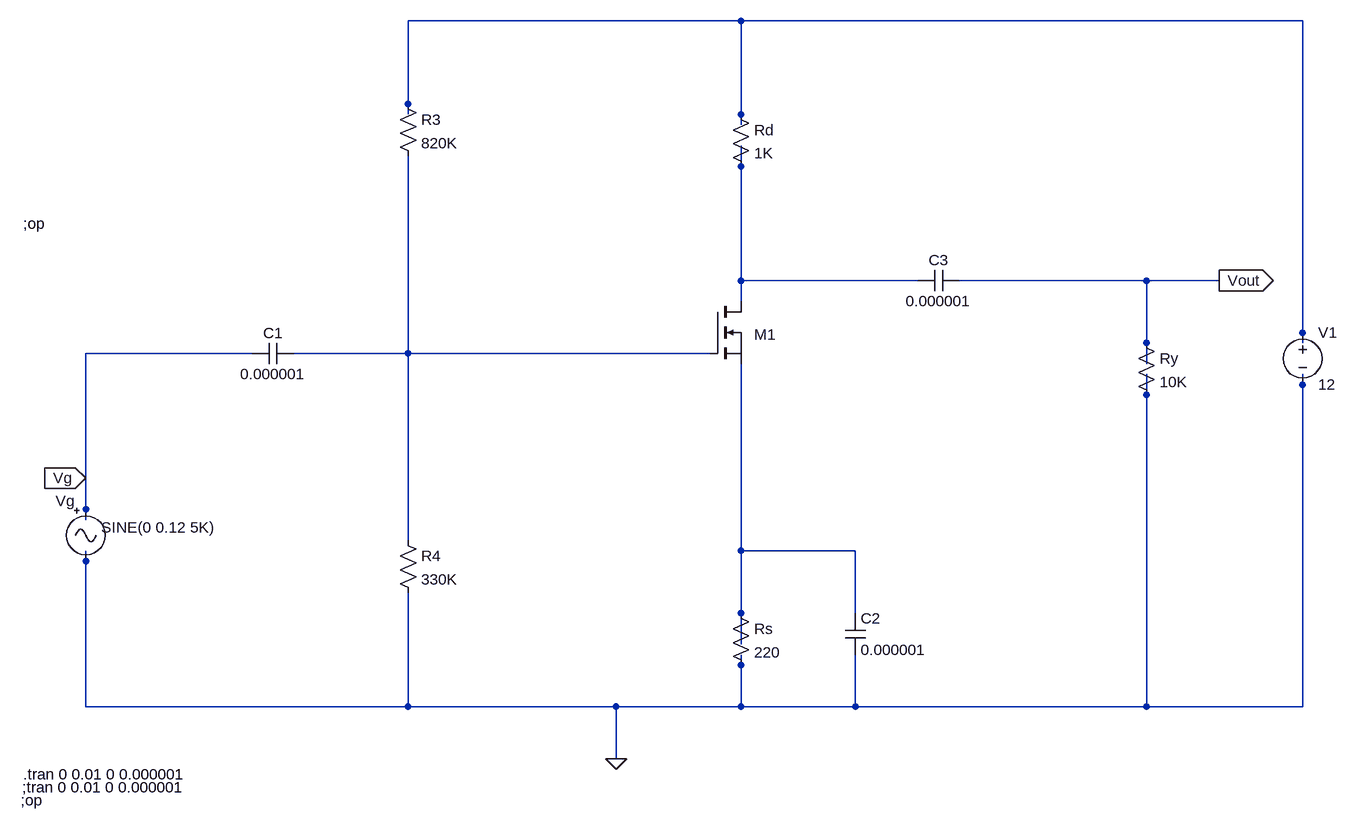
[diagram p0: schematic mosfet trimmer simulation.asc]
mosfet trimmer simulation.asc, the LTspice schematic file:
Version 4
SHEET 1 1988 680
WIRE -16 -1488 -528 -1488
WIRE 848 -1488 -16 -1488
WIRE -528 -1360 -528 -1488
WIRE -528 -1344 -528 -1360
WIRE -16 -1344 -16 -1488
WIRE -16 -1328 -16 -1344
WIRE -16 -1264 -16 -1296
WIRE -16 -1088 -16 -1264
WIRE 256 -1088 -16 -1088
WIRE 608 -1088 320 -1088
WIRE 720 -1088 608 -1088
WIRE -16 -1056 -16 -1088
WIRE 848 -1008 848 -1488
WIRE 608 -992 608 -1088
WIRE 848 -992 848 -1008
WIRE -768 -976 -1024 -976
WIRE -528 -976 -528 -1280
WIRE -528 -976 -704 -976
WIRE -64 -976 -528 -976
WIRE 608 -960 608 -992
WIRE 848 -928 848 -944
WIRE 608 -912 608 -944
WIRE -1024 -784 -1024 -976
WIRE -1024 -736 -1024 -784
WIRE -1024 -720 -1024 -736
WIRE -528 -688 -528 -976
WIRE -16 -672 -16 -960
WIRE 160 -672 -16 -672
WIRE -1024 -656 -1024 -672
WIRE -16 -576 -16 -672
WIRE 160 -576 160 -672
WIRE -16 -528 -16 -576
WIRE -16 -496 -16 -512
WIRE -1024 -432 -1024 -656
WIRE -528 -432 -528 -608
WIRE -528 -432 -1024 -432
WIRE -208 -432 -528 -432
WIRE -16 -432 -16 -496
WIRE -16 -432 -208 -432
WIRE 160 -432 160 -512
WIRE 160 -432 -16 -432
WIRE 608 -432 608 -912
WIRE 608 -432 160 -432
WIRE 848 -432 848 -928
WIRE 848 -432 608 -432
WIRE -208 -352 -208 -432
FLAG -208 -352 0
FLAG -1024 -784 Vg
IOPIN -1024 -784 In
FLAG 720 -1088 Vout
IOPIN 720 -1088 Out
DATAFLAG 848 -1216 ""
DATAFLAG -16 -816 ""
DATAFLAG 448 -1088 ""
DATAFLAG -16 -1152 ""
DATAFLAG -176 -976 ""
DATAFLAG -1024 -832 ""
SYMBOL res -544 -704 R0
SYMATTR InstName R4
SYMATTR Value 330K
SYMBOL res -32 -592 R0
SYMATTR InstName Rs
SYMATTR Value 220
SYMBOL res -32 -1360 R0
SYMATTR InstName Rd
SYMATTR Value 1K
SYMBOL res -544 -1376 R0
SYMATTR InstName R3
SYMATTR Value 820K
SYMBOL res 592 -1008 R0
SYMATTR InstName Ry
SYMATTR Value 10K
SYMBOL Misc\\signal -1024 -752 R0
WINDOW 0 -46 3 Left 2
WINDOW 3 24 44 Left 2
WINDOW 123 24 44 Left 2
WINDOW 39 0 0 Left 0
SYMATTR InstName Vg
SYMATTR Value SINE(0 0.12 5K)
SYMBOL cap 144 -576 R0
SYMATTR InstName C2
SYMATTR Value 0.000001
SYMBOL cap 320 -1072 M270
WINDOW 0 32 32 VTop 2
WINDOW 3 0 32 VBottom 2
SYMATTR InstName C3
SYMATTR Value 0.000001
SYMBOL cap -704 -992 R90
WINDOW 0 0 32 VBottom 2
WINDOW 3 32 32 VTop 2
SYMATTR InstName C1
SYMATTR Value 0.000001
SYMBOL voltage 848 -1024 R0
WINDOW 123 0 0 Left 0
WINDOW 39 0 0 Left 0
SYMATTR InstName V1
SYMATTR Value 12
SYMBOL nmos -64 -1056 R0
WINDOW 0 68 51 Left 2
WINDOW 3 56 72 Invisible 2
SYMATTR InstName M1
SYMATTR Value Si9420DY
TEXT -1120 -1176 Left 2 !;op
TEXT -1120 -328 Left 2 !.tran 0 0.01 0 0.000001
TEXT -1122 -308 Left 2 !;tran 0 0.01 0 0.000001
TEXT -1124 -288 Left 2 !;op

The netlist it stands for:
* mosfet trimmer simulation.asc
R4 N003 0 330K
Rs N004 0 220
Rd N001 N002 1K
R3 N001 N003 820K
Ry Vout 0 10K
Vg Vg 0 SINE(0 0.12 5K)
C2 N004 0 0.000001
C3 Vout N002 0.000001
C1 N003 Vg 0.000001
V1 N001 0 12
M1 N002 N003 N004 N004 Si9420DY
.model NMOS NMOS
.model PMOS PMOS
.lib standard.mos
;op
.tran 0 0.01 0 0.000001
;tran 0 0.01 0 0.000001
;op
.backanno
.end